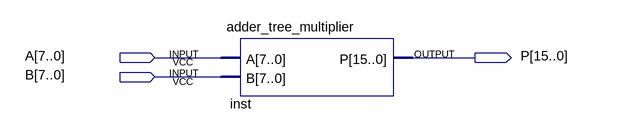
[diagram p0: schematic sheet]
// Quartus schematic Lab6Part5_Test.bdf as structural Verilog: 1 symbols, 3 pins
module Lab6Part5_Test (
  input  [7:0] A,
  input  [7:0] B,
  output [15:0] P
);

  adder_tree_multiplier inst (.A(A), .B(B), .P(P));
endmodule
